# EAGLE design Ham-Dip-002 (EAGLE 8.2.1)
VCC: 5v
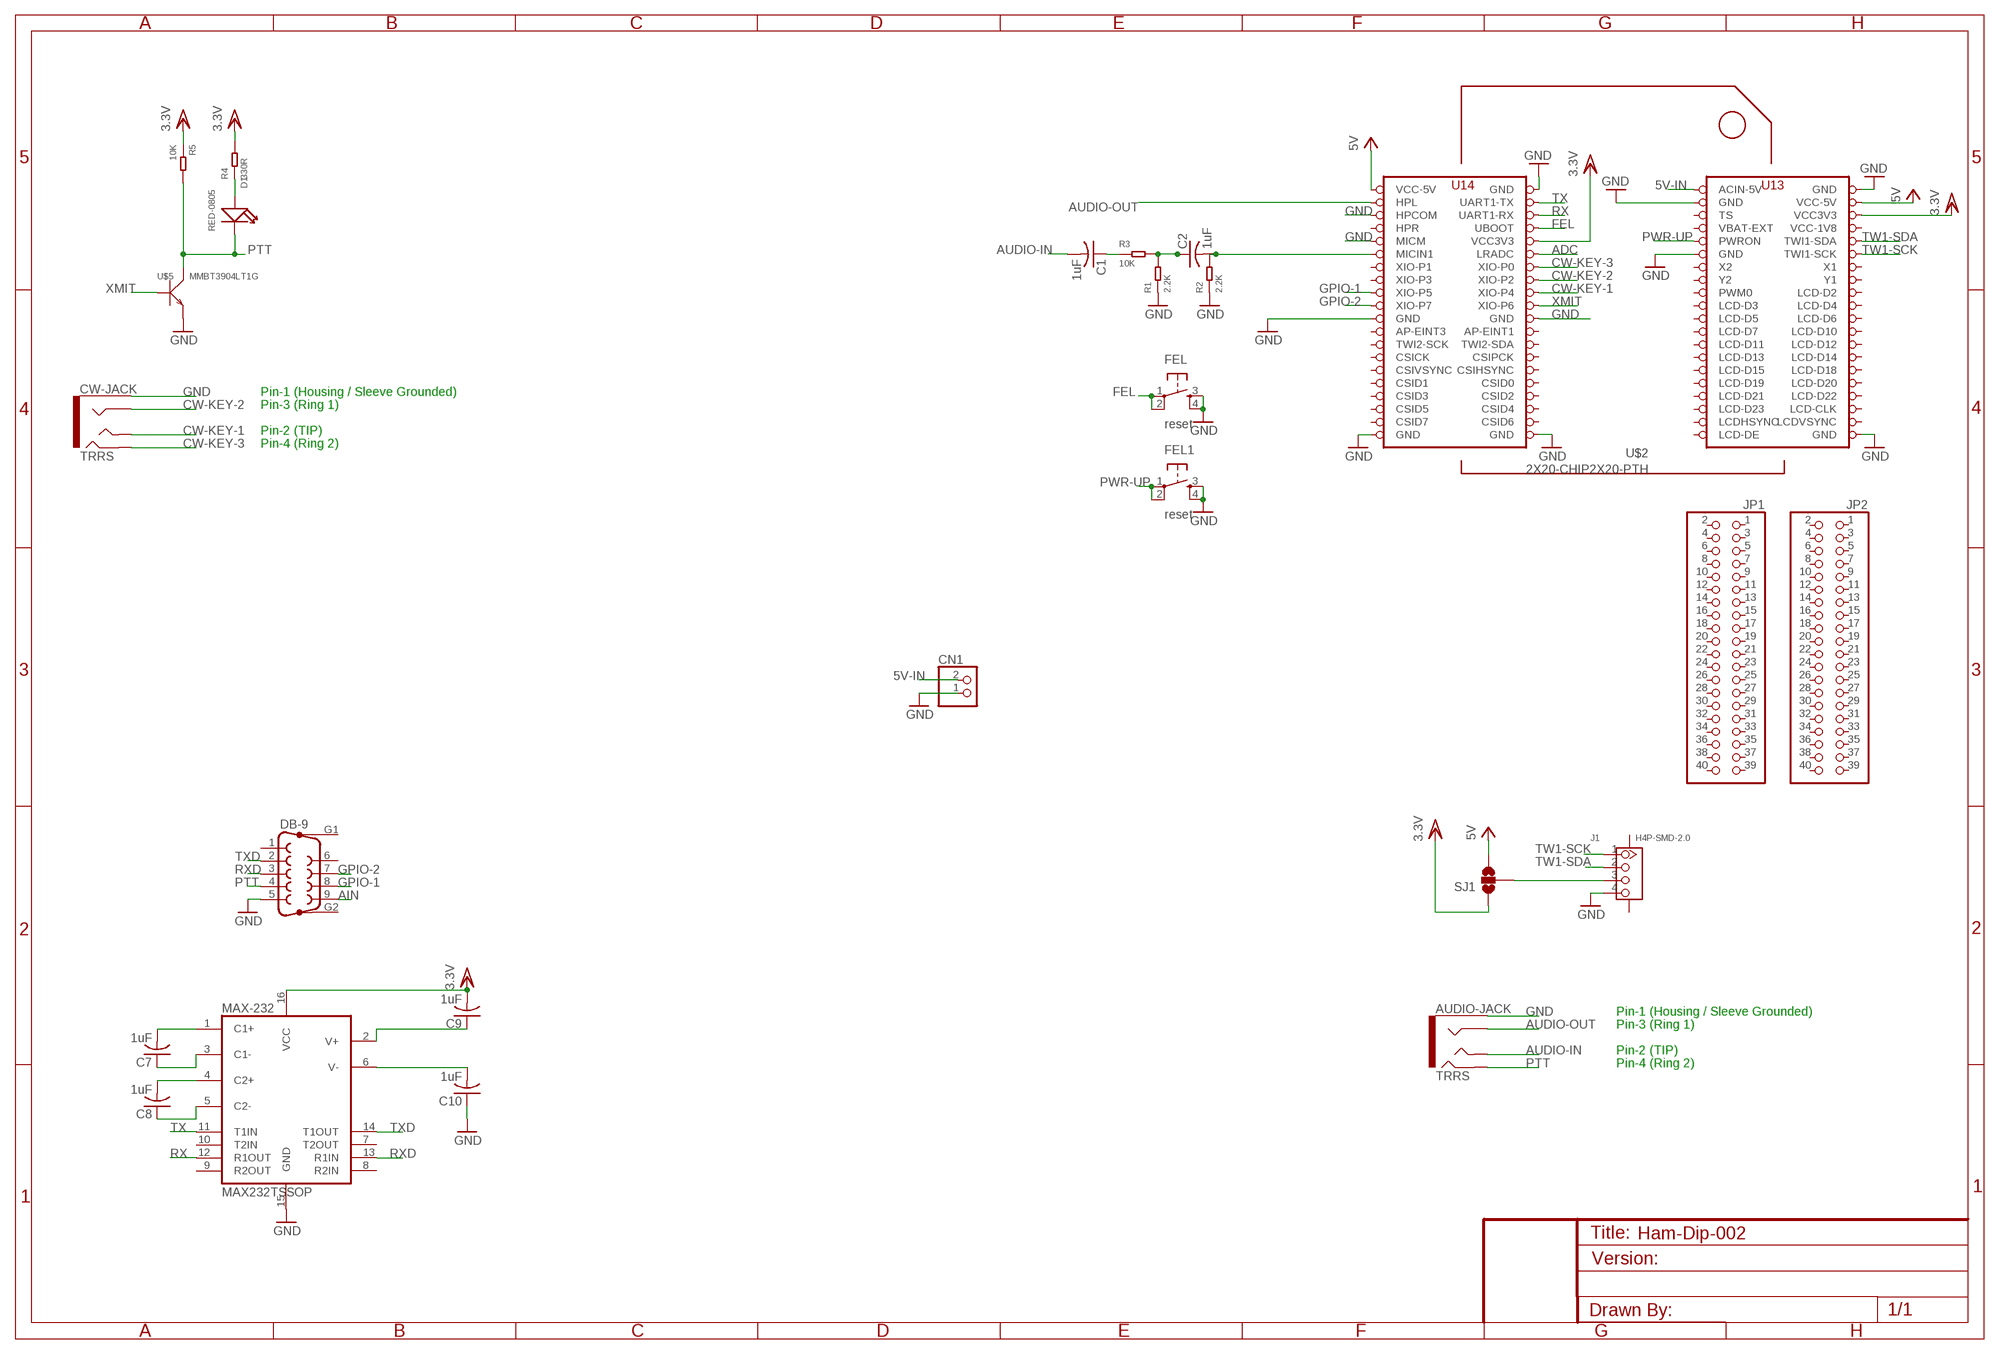
[diagram p0: schematic, sheet 1]

## Parts
AUDIO-JACK  TRRS  AUDIO-JACK3  [AUDIO-JACK-TRRS-SMD]
C1  1uF  C-USC0805  [C0805]
C2  1uF  C-USC0805  [C0805]
C7  1uF  C-USC0805  [C0805]
C8  1uF  C-USC0805  [C0805]
C9  1uF  C-USC0805  [C0805]
C10  1uF  C-USC0805  [C0805]
CN1  JST_2PIN-SMT  [JST-PH-2-SMT]
CW-JACK  TRRS  AUDIO-JACK3  [AUDIO-JACK-TRRS-SMD]
D1  RED-0805  SMD-LED-CLEAR-RED(0805)  [LED-0805]
DB-9  F09HP  [F09HP]
FEL  reset  TAC_SWITCHSMD  [TACTILE_SWITCH_SMD]
FEL1  reset  TAC_SWITCHSMD  [TACTILE_SWITCH_SMD]
J1  H4P-SMD-2.0  GROVE-CONNECTOR-SMD(4+2P-2.0)  [HW4-SMD-2.0]
JP1  PINHD-2X20  [2X20]
JP2  PINHD-2X20  [2X20]
MAX-232  MAX232TSSOP  [TSSOP16]
R1  2.2K  SMD-RES-2.2K-5%-1/8W(0805)  [R0805]
R2  2.2K  SMD-RES-2.2K-5%-1/8W(0805)  [R0805]
R3  10K  SMD-RES-10K-1%-1/8W(0805)  [R0805]
R4  330R  SMD-RES-220R-5%-1/8W(0805)  [R0805]
R5  10K  SMD-RES-10K-1%-1/8W(0805)  [R0805]
SJ1  SMD_SJ_3WAY_OPENT  [SMD_SJ_3WAY_OPEN]
U$2  2X20-CHIP2X20-PTH  2X20-CHIP2X20-PTH-CHIP_A  [2X20CHIP-TH]
U$5  MMBT3904LT1G  SMD-TRANSISTORS-NPN-40V-200MA-MMBT3904LT1G(SOT-23)  [SOT-23]

## Nets
5V-IN: CN1.2 U$2.CHG-IN(ACIN-5V)
ADC: U$2.LRADC
AIN: DB-9.9
AUDIO-IN: AUDIO-JACK.TIP C1.2
AUDIO-OUT: AUDIO-JACK.RING1 U$2.HPL
CW-KEY-1: CW-JACK.TIP U$2.XIO-P4
CW-KEY-2: CW-JACK.RING1 U$2.XIO-P2
CW-KEY-3: CW-JACK.RING2 U$2.XIO-P0
FEL: FEL.1 FEL.2 U$2.FEL(UBOOT)
GND: AUDIO-JACK.EARTH C10.1 CN1.1 CW-JACK.EARTH DB-9.5 FEL1.3 FEL1.4 FEL.3 FEL.4 J1.4 MAX-232.15(GND) R1.1 R2.1 U$2.GND@1(GND) U$2.GND@2(GND) U$2.GND@3(GND) U$2.GND@4(GND) U$2.GND@5(GND) U$2.GND@6(GND) U$2.GND@7(GND) U$2.GND@8(GND) U$2.GND@10(GND) U$2.HPCOM U$2.MICM U$5.2(E)
GPIO-1: DB-9.8 U$2.XIO-P5
GPIO-2: DB-9.7 U$2.XIO-P7
MIC-IN: C2.2 R2.2 U$2.MICIN1
N$1: D1.+ R4.1
N$3: C1.1 R3.1
N$4: C2.1 R1.2 R3.2
N$5: J1.3 SJ1.2
N$6: C9.1 MAX-232.2(V+)
N$11: C10.2 MAX-232.6(V-)
N$16: C7.2 MAX-232.1(C1+)
N$17: C8.2 MAX-232.4(C2+)
N$18: C7.1 MAX-232.3(C1-)
N$19: C8.1 MAX-232.5(C2-)
PTT: AUDIO-JACK.RING2 D1.- DB-9.4 R5.2 U$5.3(C)
PWR-UP: FEL1.1 FEL1.2 U$2.PWRON
RX: MAX-232.12(R1OUT) U$2.UART1-RX
RXD: DB-9.3 MAX-232.13(R1IN)
TW1-SCK: J1.1 U$2.TWI1-SCK
TW1-SDA: J1.2 U$2.TWI1-SDA
TX: MAX-232.11(T1IN) U$2.UART1-TX
TXD: DB-9.2 MAX-232.14(T1OUT)
VCC: SJ1.3 U$2.VCC5V@0(VCC-5V) U$2.VCC5V@1(VCC-5V) ; supply symbol labelled 5V
VCC/2: C9.2 MAX-232.16(VCC) R4.2 R5.1 SJ1.1 U$2.VCC3V3 U$2.VCC3V3@1(VCC3V3) ; supply symbol labelled 3.3V
XMIT: U$2.XIO-P6 U$5.1(B)
Unconnected: DB-9.1 DB-9.6 DB-9.G1 DB-9.G2 J1.SS1 J1.SS2 JP1.1 JP1.2 JP1.3 JP1.4 JP1.5 JP1.6 JP1.7 JP1.8 JP1.9 JP1.10 JP1.11 JP1.12 JP1.13 JP1.14 JP1.15 JP1.16 JP1.17 JP1.18 JP1.19 JP1.20 JP1.21 JP1.22 JP1.23 JP1.24 JP1.25 JP1.26 JP1.27 JP1.28 JP1.29 JP1.30 JP1.31 JP1.32 JP1.33 JP1.34 JP1.35 JP1.36 JP1.37 JP1.38 JP1.39 JP1.40 JP2.1 JP2.2 JP2.3 JP2.4 JP2.5 JP2.6 JP2.7 JP2.8 JP2.9 JP2.10 JP2.11 JP2.12 JP2.13 JP2.14 JP2.15 JP2.16 JP2.17 JP2.18 JP2.19 JP2.20 JP2.21 JP2.22 JP2.23 JP2.24 JP2.25 JP2.26 JP2.27 JP2.28 JP2.29 JP2.30 JP2.31 JP2.32 JP2.33 JP2.34 JP2.35 JP2.36 JP2.37 JP2.38 JP2.39 JP2.40 MAX-232.7(T2OUT) MAX-232.8(R2IN) MAX-232.9(R2OUT) MAX-232.10(T2IN) U$2.AP-EINT1 U$2.AP-EINT3 U$2.BAT(VBAT-EXT) U$2.CSICK U$2.CSID0 U$2.CSID1 U$2.CSID2 U$2.CSID3 U$2.CSID4 U$2.CSID5 U$2.CSID6 U$2.CSID7 U$2.CSIHSYNC U$2.CSIPCK U$2.CSIVSYNC U$2.HPR U$2.LCD-CLK U$2.LCD-D2 U$2.LCD-D3 U$2.LCD-D4 U$2.LCD-D5 U$2.LCD-D6 U$2.LCD-D7 U$2.LCD-D10 U$2.LCD-D11 U$2.LCD-D12 U$2.LCD-D13 U$2.LCD-D14 U$2.LCD-D15 U$2.LCD-D18 U$2.LCD-D19 U$2.LCD-D20 U$2.LCD-D21 U$2.LCD-D22 U$2.LCD-D23 U$2.LCD-DE U$2.LCD-HSYNC(LCDHSYNC) U$2.LCD-VSYNC(LCDVSYNC) U$2.PWM0 U$2.TS U$2.TWI2-SCK U$2.TWI2-SDA U$2.X1 U$2.X2 U$2.XIO-P1 U$2.XIO-P3 U$2.Y1 U$2.Y2

## Notes on the sheet
- Pin-1 (Housing / Sleeve Grounded)
- Pin-3 (Ring 1)
- Pin-2 (TIP)
- Pin-4 (Ring 2)
- Pin-1 (Housing / Sleeve Grounded)
- Pin-3 (Ring 1)
- Pin-2 (TIP)
- Pin-4 (Ring 2)

## Power pins joined to a net without a drawn wire
VCC-1V8: U$2.VCC1V8(VCC-1V8)

## Library data of the parts
AUDIO-JACK CW-JACK = SparkFun-Connectors:AUDIO-JACK3: Audio jack - 3.5mm TRRS variety - two rings.
C1 C2 C7-C10 = adafruit:C-US: CAPACITOR, American symbol
CN1 = adafruit:JST_2PIN: JST 2-Pin Connectors of various flavors SMT-RA (S2B-PH-SM4) 4UConnector #17311 SMT (B2B-PH-SM4) THM-RA (S2B-PH) THM (B2B-PH)
D1 = Seeed-LED-2016:SMD-LED-CLEAR-RED(0805): 304090046; MPN: 17-215SURC/S530-A2/TR8
DB-9 = con-subd:F09HP: SUB-D; OC_FARNELL: unknown; OC_NEWARK: unknown
FEL FEL1 = SparkFun-Electromechanical:TAC_SWITCH: Momentary Switch Button commonly used for reset or general input. Spark Fun Electronics SKU : COM-00097 SMT- SWCH-08247; PROD_ID: SWCH-08247
J1 = Seeed-Connector -2016:GROVE-CONNECTOR-SMD(4+2P-2.0): 320110030
JP1 JP2 = adafruit:PINHD-2X20: PIN HEADER
MAX-232 = SparkFun-DigitalIC:MAX232: RS232 Transceiver Very common IC. This is generically called 'MAX232', but works with the 3V equivalent MAX3232 generic ICs. Field tested and mother approved. Spark Fun Electronics SKU : COM-00316 (DIP) and COM-00589 (SMD)
R1 R2 = Seeed-Resistor-2016:SMD-RES-2.2K-5%-1/8W(0805): 301010333; MPN: RC0805JR-072K2L
R3 R5 = Seeed-Resistor-2016:SMD-RES-10K-1%-1/8W(0805): 301010361; MPN: RC0805FR-0710KL
R4 = Seeed-Resistor-2016:SMD-RES-220R-5%-1/8W(0805): 301010315; MPN: RC0805JR-07220RL; VALUE: 220R
SJ1 = JKW_CHIP:SMD_SJ_3WAY_OPEN: Solder Jumper 2 way solder jumper
U$2 = JKW_CHIP:2X20-CHIP: Chip header; DESCRIPTION: 2x20 .100" headers; FOOTPRINT: 2x20 .100" CHIP foot print; VENDOR: ASSMANN; VENDOR_PART_NUMBER: AWHW40-G-SMD-R (single)
U$5 = Seeed-Transistor-2016:SMD-TRANSISTORS-NPN-40V-200MA-MMBT3904LT1G(SOT-23): 305010013; MPN: MMBT3904LT1G

## Board
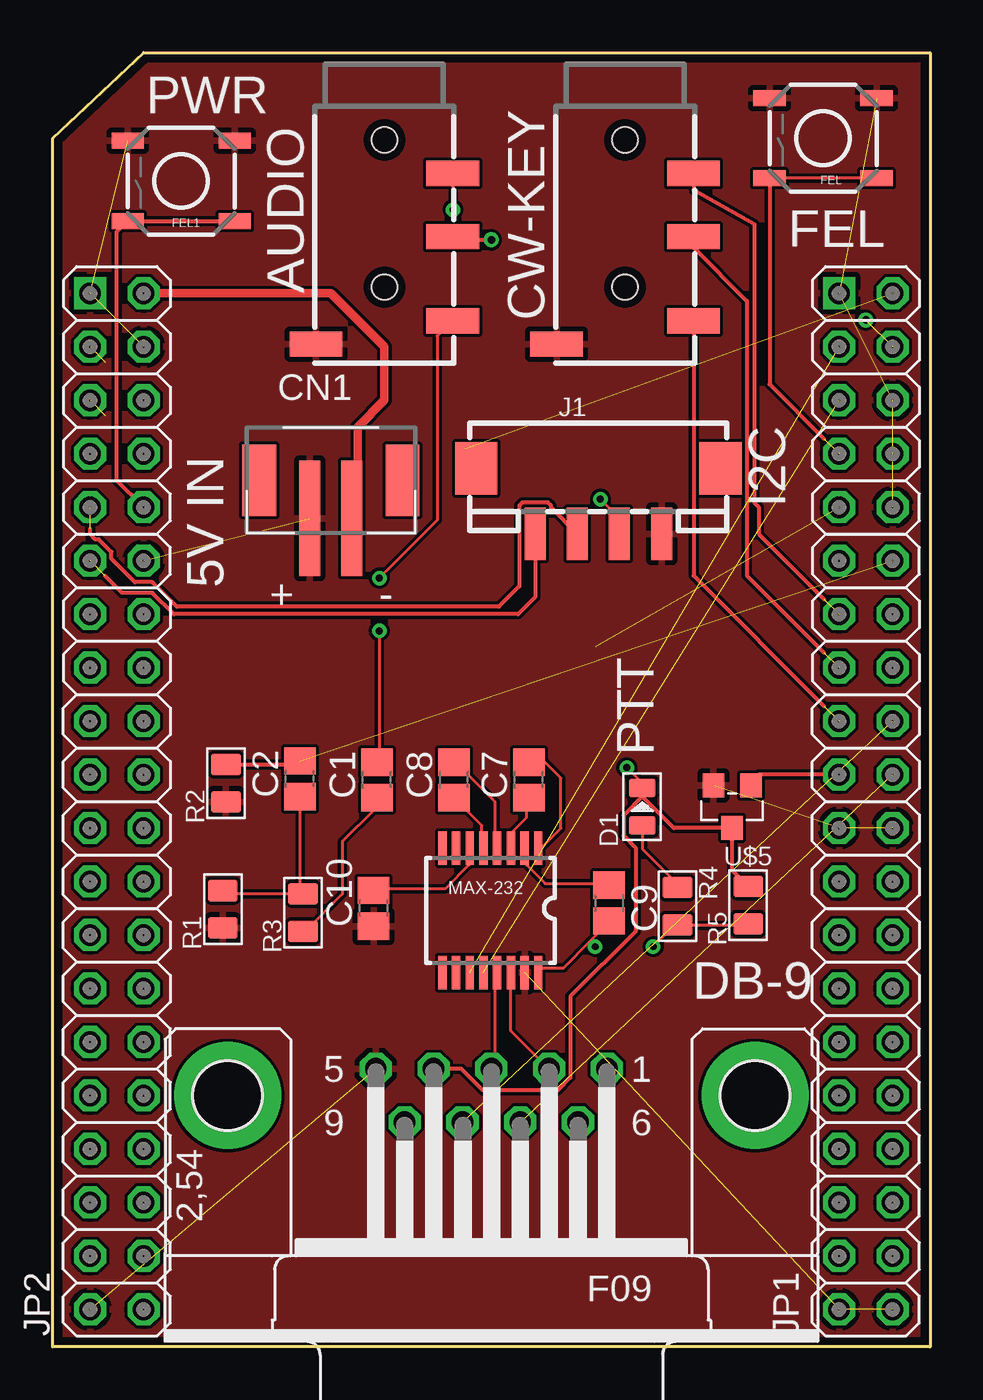
[diagram p1: board, top side]
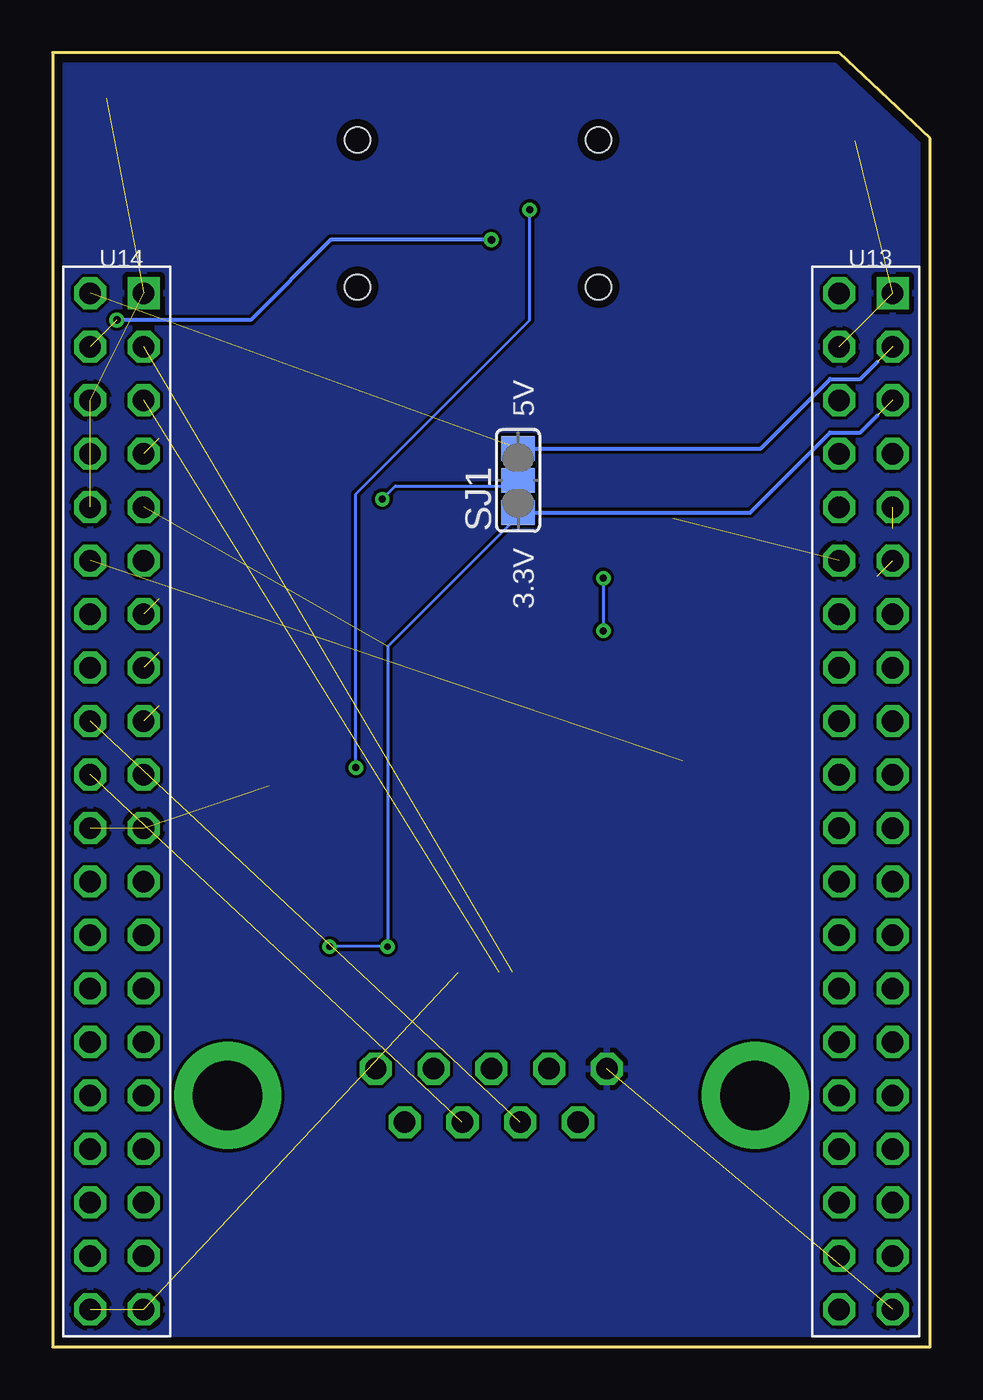
[diagram p2: board, bottom side, seen from below]

Size 41.66 x 61.47 mm. Coordinates in mm from the lower left corner, seen from the top.
Outline: 0,0 0,57.4 4.32,61.47 41.66,61.47 41.66,0 0,0
Copper layers (1*16): Top 0.0356mm / dielectric 1.5011mm / Bottom 0.0356mm
Design rules "LaenPCBOrder": minimum track width 6mil, minimum drill 13mil, track to track 6mil, track to pad 6mil, pad to pad 6mil, via to via 6mil, smd to smd 6mil, copper to edge 15mil, drill to drill 6mil, minimum pad ring 7mil, minimum via ring 7mil, stop-mask expansion 4mil, vias tented up to drill 0mil, thermal gap 10mil

### Footprints (pad centres in the part's own frame; a part is rotated, then mirrored left to right if it is on the bottom)
AUDIO-JACK-TRRS-SMD = smd 1.2 x 2.5: EARTH 11.3,-3.25; RING1 6.2,3.25; RING2 3.2,3.25; TIP 10.2,3.25 | hole 1.2: 1.6,0; 8.6,0
C0805 = smd 1.3 x 1.5: 1 -0.85,0; 2 0.85,0
JST-PH-2-SMT = smd 1 x 5.5: 1 -1,-1.8; 2 1,-1.8 | smd 1.6 x 3.4: NC1 -3.4,0; NC2 3.4,0
LED-0805 = smd 0.889 x 1.27: + -0.889,0; - 0.889,0
F09HP = drill 1.016 octagon: 1 -5.486,-1.27; 2 -2.743,-1.27; 3 0,-1.27; 4 2.743,-1.27; 5 5.486,-1.27; 6 -4.115,1.27; 7 -1.372,1.27; 8 1.372,1.27; 9 4.115,1.27 | drill 3.302 pad 5.08: G1 -12.522,0; G2 12.522,0
TACTILE_SWITCH_SMD = smd 1.524 x 0.762: 1 -2.54,1.905; 2 2.54,1.905; 3 -2.54,-1.905; 4 2.54,-1.905
HW4-SMD-2.0 = smd 1 x 2.5: 1 -3,0; 2 -1,0; 3 1,0; 4 3,0 | smd 2 x 2.5: SS1 -5.8,3.123; SS2 5.8,3.123
2X20 = drill 1.016 octagon: 1 -24.13,-1.27; 2 -24.13,1.27; 3 -21.59,-1.27; 4 -21.59,1.27; 5 -19.05,-1.27; 6 -19.05,1.27; 7 -16.51,-1.27; 8 -16.51,1.27; 9 -13.97,-1.27; 10 -13.97,1.27; 11 -11.43,-1.27; 12 -11.43,1.27; 13 -8.89,-1.27; 14 -8.89,1.27; 15 -6.35,-1.27; 16 -6.35,1.27; 17 -3.81,-1.27; 18 -3.81,1.27; 19 -1.27,-1.27; 20 -1.27,1.27; 21 1.27,-1.27; 22 1.27,1.27; 23 3.81,-1.27; 24 3.81,1.27; 25 6.35,-1.27; 26 6.35,1.27; 27 8.89,-1.27; 28 8.89,1.27; 29 11.43,-1.27; 30 11.43,1.27; 31 13.97,-1.27; 32 13.97,1.27; 33 16.51,-1.27; 34 16.51,1.27; 35 19.05,-1.27; 36 19.05,1.27; 37 21.59,-1.27; 38 21.59,1.27; 39 24.13,-1.27; 40 24.13,1.27
TSSOP16 = smd 0.4 x 1.6: 1 -2.225,-2.85; 2 -1.575,-2.85; 3 -0.925,-2.85; 4 -0.275,-2.85; 5 0.375,-2.85; 6 1.025,-2.85; 7 1.675,-2.85; 8 2.325,-2.85; 9 2.325,3.05; 10 1.675,3.05; 11 1.025,3.05; 12 0.375,3.05; 13 -0.275,3.05; 14 -0.925,3.05; 15 -1.575,3.05; 16 -2.225,3.05
R0805 = smd 1.397 x 1.016: 1 0,0.889; 2 0,-0.889
SMD_SJ_3WAY_OPEN = smd 1.168 x 1.6: 1 -1.524,0; 2 0,0; 3 1.524,0
2X20CHIP-TH = drill 1.016: AP-EINT1 36.83,21.59; AP-EINT3 39.37,21.59; BAT 3.81,41.91; CHG-IN 3.81,49.53; CSICK 39.37,16.51; CSID0 36.83,11.43; CSID1 39.37,11.43; CSID2 36.83,8.89; CSID3 39.37,8.89; CSID4 36.83,6.35; CSID5 39.37,6.35; CSID6 36.83,3.81; CSID7 39.37,3.81; CSIHSYNC 36.83,13.97; CSIPCK 36.83,16.51; CSIVSYNC 39.37,13.97; FEL 36.83,41.91; GND@1 3.81,36.83; GND@2 1.27,1.27; GND@4 39.37,24.13; GND@5 39.37,1.27; GND@6 36.83,1.27; GND@7 36.83,24.13; GND@10 3.81,46.99; HPCOM 39.37,44.45; HPL 39.37,46.99; HPR 39.37,41.91; LCD-CLK 1.27,6.35; LCD-D2 1.27,29.21; LCD-D3 3.81,26.67; LCD-D4 1.27,26.67; LCD-D5 3.81,24.13; LCD-D6 1.27,24.13; LCD-D7 3.81,21.59; LCD-D10 1.27,21.59; LCD-D11 3.81,19.05; LCD-D12 1.27,19.05; LCD-D13 3.81,16.51; LCD-D14 1.27,16.51; LCD-D15 3.81,13.97; LCD-D18 1.27,13.97; LCD-D19 3.81,11.43; LCD-D20 1.27,11.43; LCD-D21 3.81,8.89; LCD-D22 1.27,8.89; LCD-D23 3.81,6.35; LCD-DE 3.81,1.27; LCD-HSYNC 3.81,3.81; LCD-VSYNC 1.27,3.81; LRADC 36.83,36.83; MICIN1 39.37,36.83; MICM 39.37,39.37; PWM0 3.81,29.21; PWRON 3.81,39.37; TS 3.81,44.45; TWI1-SCK 1.27,36.83; TWI1-SDA 1.27,39.37; TWI2-SCK 39.37,19.05; TWI2-SDA 36.83,19.05; UART1-RX 36.83,44.45; UART1-TX 36.83,46.99; VCC1V8 1.27,41.91; VCC3V3 1.27,44.45; VCC3V3@1 36.83,39.37; VCC5V@0 1.27,46.99; VCC5V@1 39.37,49.53; X1 1.27,34.29; X2 3.81,34.29; XIO-P0 36.83,34.29; XIO-P1 39.37,34.29; XIO-P2 36.83,31.75; XIO-P3 39.37,31.75; XIO-P4 36.83,29.21; XIO-P5 39.37,29.21; XIO-P6 36.83,26.67; XIO-P7 39.37,26.67; Y1 1.27,31.75; Y2 3.81,31.75 | drill 1.016 square: GND@3 1.27,49.53; GND@8 36.83,49.53
SOT-23 = smd 1.016 x 1.143: 1 -0.889,-1.016; 2 0.889,-1.016; 3 0,1.016

### Placement (x,y rotation side)
AUDIO-JACK  15.75,58.93 270 top
C1  15.39,26.92 90 top
C2  11.73,26.97 90 top
C7  22.61,26.92 90 top
C8  19.05,26.92 90 top
C9  26.42,21.08 270 top
C10  15.24,20.83 90 top
CN1  13.21,41.15 0 top
CW-JACK  27.18,58.93 270 top
D1  27.99,25.65 90 top
DB-9  20.83,11.94 180 top
FEL  36.58,57.4 180 top
FEL1  6.1,55.37 180 top
J1  25.91,38.61 0 top
JP1  38.61,25.91 90 top
JP2  3.05,25.91 90 top
MAX-232  20.83,20.83 180 top
R1  8.08,20.78 180 top
R2  8.23,26.77 180 top
R3  11.89,20.62 180 top
R4  29.67,20.93 0 top
R5  33.02,20.98 180 top
SJ1  19.56,41.15 90 bottom
U$2  0.51,0.51 0 top
U$5  32.26,25.65 180 top

### Tracks (layer width: path | path; a pad name or v marks a point on that pad's centre or on a via)
5V-IN
  Top 0.152: CN1.2 14.26,39.51 14.51,39.76 14.48,39.88
  Top 0.406: U$2.CHG-IN 13.21,50.04 15.75,47.5 15.75,44.96 14.48,43.69 14.48,39.88
AUDIO-IN  (via drill 0.33)
  Top 0.152: v15.51,34.01 15.51,28.01 C1.2 | v15.51,36.51 18.26,39.26 18.26,48.01 18.76,48.51 AUDIO-JACK.TIP
  Bottom 0.152: v15.51,36.51 v15.51,34.01
AUDIO-OUT  (via drill 0.35)  (1 unrouted)
  Top 0.2: v20.83,52.58 19.56,52.58 AUDIO-JACK.RING1
  Bottom 0.2: v38.61,48.77 32.26,48.77 28.45,52.58 v20.83,52.58
CW-KEY-1  (1 unrouted)
  Top 0.2: CW-JACK.TIP 30.43,36.63 36.62,30.43
CW-KEY-2  (1 unrouted)
  Top 0.2: CW-JACK.RING1 30.43,52.21 32.96,49.67 32.96,36.64 36.62,32.98
CW-KEY-3  (1 unrouted)
  Top 0.2: CW-JACK.RING2 30.43,54.94 33.31,53.32 33.31,40.09 33.53,39.88 33.53,38.61 36.62,35.52
FEL  (1 unrouted)
  Top 0.152: FEL.2 34.13,55.51 39.01,55.51 FEL.1
  Top 0.2: FEL.2 34.04,45.72 36.62,43.14
GND  (11 unrouted)
  pour Bottom: -2.03,61.47 41.15,61.47 42.42,-0.76 -2.03,-0.76
  pour Top: -4.57,61.47 41.15,61.47 41.15,-2.03 -4.57,-2.03
GPIO-1  (1 unrouted)
GPIO-2  (1 unrouted)
MIC-IN  (1 unrouted)
  Top 0.2: R2.2 11.57,27.66 C2.2
N$1
  Top 0.152: D1.+ 28.01,24.76 28.01,23.63 29.76,21.88 R4.1
N$3
  Top 0.152: R3.1 12.01,19.76 13.76,21.51 13.76,24.01 15.26,25.51 15.26,26.01 C1.1
N$4
  Top 0.152: R1.2 8.26,21.51 11.76,21.51 R3.2 11.76,21.76 11.76,26.01 C2.1
N$5  (via drill 0.33)
  Top 0.152: v26.01,40.26 26.88,39.38 26.88,38.63 J1.3
  Bottom 0.152: v26.01,40.26 25.38,40.88 19.88,40.88 19.63,41.13 SJ1.2
N$6
  Top 0.152: C9.1 26.38,22.01 23.38,22.01 22.51,22.88 22.51,23.63 MAX-232.2
N$11
  Top 0.152: C10.2 15.26,21.76 18.63,21.76 19.76,22.88 19.76,23.63 MAX-232.6
N$16
  Top 0.152: C7.2 22.63,27.76 23.38,27.76 24.13,27.01 24.13,24.63 23.13,23.63 MAX-232.1
N$17
  Top 0.152: C8.2 19.13,27.76 21.01,25.88 21.01,23.76 MAX-232.4
N$18
  Top 0.152: C7.1 22.51,26.01 22.51,25.13 21.76,24.38 21.76,23.76 MAX-232.3
N$19
  Top 0.152: C8.1 19.13,26.01 20.38,24.76 20.38,23.76 MAX-232.5
PTT  (via drill 0.33)
  Top 0.152: v19.01,54.01 19.01,55.51 AUDIO-JACK.RING2 | v27.26,27.51 28.01,26.76 D1.-
  Top 0.2: R5.2 32.26,22.63 U$5.3 29.49,24.64 27.99,26.14 | 27.99,26.14 D1.- | 27.99,26.14 27.1,25.25 27.1,24.28 27.68,23.7 27.68,19.74 24.59,16.64 24.59,12.79 23.99,12.19 20.41,12.19 19.39,13.21 DB-9.4
  Bottom 0.152: v19.01,54.01 19.01,48.76 27.26,40.51 v27.26,27.51
PWR-UP
  Top 0.2: FEL1.1 FEL1.2 3.05,52.96 3.05,41.15 U$2.PWRON
RX  (1 unrouted)
RXD
  Top 0.152: MAX-232.13 21.01,17.76 21.01,13.38 20.88,13.26 DB-9.3
TW1-SCK  (1 unrouted)
  Top 0.2: J1.1 22.91,35.61 22.1,34.8 5.75,34.8 4.74,35.81 3.3,35.81 2.5,36.62
TW1-SDA  (1 unrouted)
  Top 0.2: J1.2 23.66,39.86 23.66,39.96 23.51,40.11 22.3,40.11 22.16,39.96 22.16,36.13 21.18,35.15 5.9,35.15 4.72,36.32 3.9,36.32 2.79,37.43 2.79,37.76 2.2,38.35 2.03,38.35 1.78,38.61 1.78,38.86
TX  (1 unrouted)
TXD
  Top 0.152: MAX-232.14 21.76,17.76 21.76,15.01 23.51,13.26 DB-9.2
VCC  (2 unrouted)
  Bottom 0.2: 2.5,46.78 3.3,45.97 4.74,45.97 8.04,42.67 SJ1.3
VCC/2  (via drill 0.33)  (2 unrouted)
  Top 0.152: R5.1 33.01,20.01 29.76,20.01 R4.2 29.51,20.01 v28.51,19.01 | 25.51,19.26 24.26,18.01 23.01,18.01 MAX-232.16 | 25.51,19.26 26.26,20.01 C9.2 | 25.51,19.26 v25.76,19.01
  Bottom 0.152: v28.51,19.01 v25.76,19.01 25.76,33.26 19.51,39.51 SJ1.1
  Bottom 0.2: 2.5,44.24 3.3,43.43 4.74,43.43 8.55,39.62 SJ1.1
XMIT
  Top 0.2: U$2.XIO-P6 33.53,27.18 33.53,27.05 U$5.1

### Text on the board
tPlace: PWR | FEL | AUDIO | CW-KEY | I2C | 5V IN | PTT
bPlace: 5V | 3.3V